# Altium schematic sheet MonitorOut.SchDoc
size A
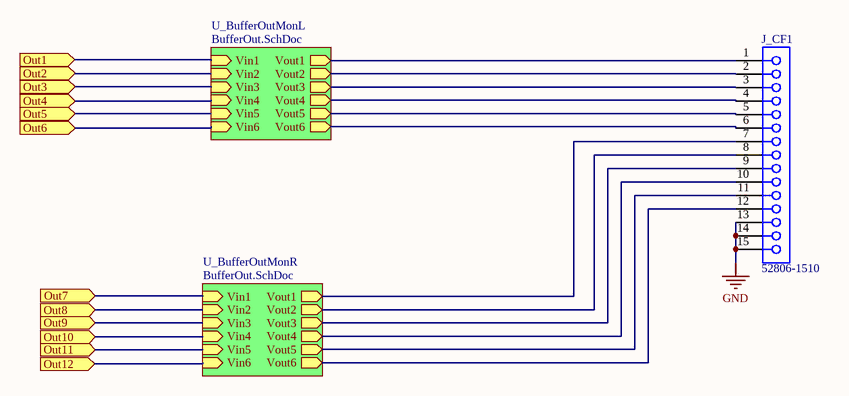
[diagram p0: MonitorOut.SchDoc]

## Parts
J_CF1  52806-1510  [MOLX-52806-1510]

## Sub-sheets
U_BufferOutMonL = BufferOut.SchDoc: Vin1 (in), Vout1 (out), Vin2 (in), Vout2 (out), Vin3 (in), Vout3 (out), Vin4 (in), Vout4 (out), Vin5 (in), Vout5 (out), Vin6 (in), Vout6 (out)
U_BufferOutMonR = BufferOut.SchDoc: Vin1 (in), Vout1 (out), Vin2 (in), Vout2 (out), Vin3 (in), Vout3 (out), Vin4 (in), Vout4 (out), Vin5 (in), Vout5 (out), Vin6 (in), Vout6 (out)

## Ports
Out1 (in), Out2 (in), Out3 (in), Out4 (in), Out5 (in), Out6 (in), Out7 (in), Out8 (in), Out9 (in), Out10 (in), Out11 (in), Out12 (in)

## Nets
GND: J_CF1.13 J_CF1.14 J_CF1.15
Out1: port Out1, sheet U_BufferOutMonL/Vin1
Out2: port Out2, sheet U_BufferOutMonL/Vin2
Out3: port Out3, sheet U_BufferOutMonL/Vin3
Out4: port Out4, sheet U_BufferOutMonL/Vin4
Out5: port Out5, sheet U_BufferOutMonL/Vin5
Out6: port Out6, sheet U_BufferOutMonL/Vin6
Out7: port Out7, sheet U_BufferOutMonR/Vin1
Out8: port Out8, sheet U_BufferOutMonR/Vin2
Out9: port Out9, sheet U_BufferOutMonR/Vin3
Out10: port Out10, sheet U_BufferOutMonR/Vin4
Out11: port Out11, sheet U_BufferOutMonR/Vin5
Out12: port Out12, sheet U_BufferOutMonR/Vin6
NetJ_CF1_1: J_CF1.1 ; sheet U_BufferOutMonL/Vout1
NetJ_CF1_2: J_CF1.2 ; sheet U_BufferOutMonL/Vout2
NetJ_CF1_3: J_CF1.3 ; sheet U_BufferOutMonL/Vout3
NetJ_CF1_4: J_CF1.4 ; sheet U_BufferOutMonL/Vout4
NetJ_CF1_5: J_CF1.5 ; sheet U_BufferOutMonL/Vout5
NetJ_CF1_6: J_CF1.6 ; sheet U_BufferOutMonL/Vout6
NetJ_CF1_7: J_CF1.7 ; sheet U_BufferOutMonR/Vout1
NetJ_CF1_8: J_CF1.8 ; sheet U_BufferOutMonR/Vout2
NetJ_CF1_9: J_CF1.9 ; sheet U_BufferOutMonR/Vout3
NetJ_CF1_10: J_CF1.10 ; sheet U_BufferOutMonR/Vout4
NetJ_CF1_11: J_CF1.11 ; sheet U_BufferOutMonR/Vout5
NetJ_CF1_12: J_CF1.12 ; sheet U_BufferOutMonR/Vout6

## Library data of the parts
J_CF1 = CMP-1242-00172-1: 1.0 mm Pitch FFC Connector, 5.4 mm Mated Height, Vertical, Non-ZIF, Through Hole, 15 Circuits, -20 to 80 degC, ELV and RoHS Compliant, Tray; Manufacturer: Molex; Voltage (Max): 50V AC (RMS)/DC; Pitch - Mating Interface: 1.00mm; Circuits (maximum): 15; Durability (mating cycles max): 10; Stackable: No; Current (Max per Contact): 0.5A; Mated Height: 5.40mm; Material - Plating Mating: Tin; PCB Retention: None; Material - Metal: Phosphor Bronze; ComponentLink3URL: http://www.molex.com/pdm_docs/sd/528061510_sd.pdf; PartNumber: 52806-1510; ComponentLink2URL: http://www.molex.com/webdocs/datasheets/pdf/en-us/0528061510_FFC_FPC_CONNECTORS.pdf; PackageVersion: Rev. B, 08/2002; Pitch - Termination Interface: 1.00mm; Circuits (Loaded): 15; PackageDescription: 15-Lead FFC Connector, Pitch 1.0 mm; ComponentLink1URL: http://www.molex.com/molex/index.jsp; Packing: Tray; ComponentLink1Description: Manufacturer URL; Entry Angle: Vertical; Contact Position: N/A; PCB Locator: No; Number of Rows: 1; ComponentLink2Description: Datasheet; Material - Plating Termination: Tin; Orientation: Vertical; RoHS: TRUE; PackageReference: 52806-1510; ComponentLink3Description: Package Specification; Mounting Technology: Through Hole; Polarized to PCB: No